# Altium schematic sheet CH9343-安卓USB转串口板V0.0.1版本.SchDoc
size A4; Organization: Altium Limited; Address1: L3, 12a Rodborough Rd; Address2: Frenchs Forest; Address3: NSW; Address4: Australia 2086
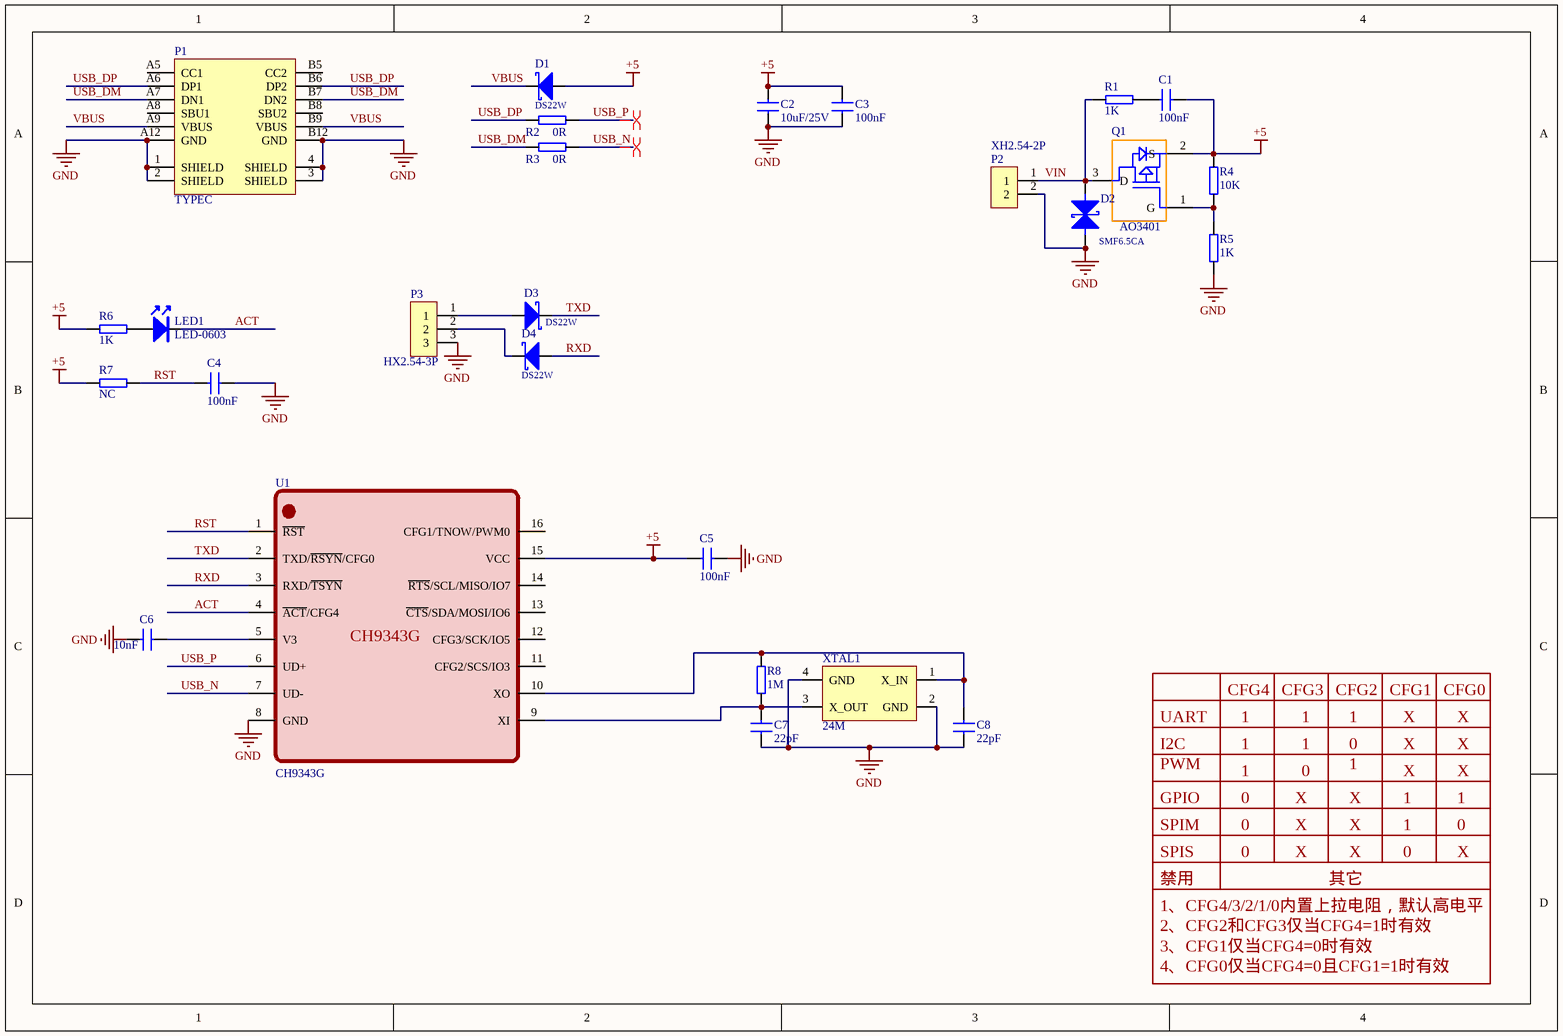
[diagram p0: CH9343-安卓USB转串口板V0.0.1版本.SchDoc]

## Parts
C1  100nF  [C-0603]
C2  10uF/25V  [C-0805]
C3  100nF  [C-0603]
C4  100nF  [C-0603]
C5  100nF  [C-0603]
C6  10nF  [C-0603]
C7  22pF  [C-0603]
C8  22pF  [C-0603]
D1  DS22W  [SOD-123F]
D2  SMF6.5CA  [DO-SOD-123FL_L2.8-W1.8-LS3.7-BI]
D3  DS22W  [SOD-123F]
D4  DS22W  [SOD-123F]
LED1  LED-0603  [LED-0603]
P1  TYPEC  [Type c-16p]
P2  XH2.54-2P  [XH2.54-2P]
P3  HX2.54-3P  [XH2.54-3P]
Q1  AO3401  [SOT-23]
R1  1K  [R-0603]
R2  0R  [R-0603]
R3  0R  [R-0603]
R4  10K  [R-0603]
R5  1K  [R-0603]
R6  1K  [R-0603]
R7  NC  [R-0603]
R8  1M  [R-0603]
U1  CH9343G  [SO-16]
XTAL1  24M  [XTAL-3225]

## Nets
+5: C1.2 C2.1 C3.2 C5.1 D1.1 Q1.2(S) R4.2 R6.2 R7.2 U1.15(VCC)
GND: C2.2 C3.1 C4.2 C5.2 C6.1 C7.1 C8.2 D2.2 P1.1(SHIELD) P1.2(SHIELD) P1.3(SHIELD) P1.4(SHIELD) P1.A12(GND) P1.B12(GND) P2.2 P3.3 R5.1 U1.8(GND) XTAL1.2(GND) XTAL1.4(GND)
ACT: LED1.2 U1.4(~{ACT}/CFG4)
RST: C4.1 R7.1 U1.1(~{RST})
RXD: D4.1 U1.3(RXD/~{TSYN})
TXD: D3.2 U1.2(TXD/~{RSYN}/CFG0)
USB_DM: P1.A7(DN1) P1.B7(DN2) R3.1
USB_DP: P1.A6(DP1) P1.B6(DP2) R2.1
USB_N: R3.2 U1.7(UD-)
USB_P: R2.2 U1.6(UD+)
VBUS: D1.2 P1.A9(VBUS) P1.B9(VBUS)
VIN: D2.1 P2.1 Q1.3(D) R1.2
NetC1_1: C1.1 R1.1
NetC6_2: C6.2 U1.5(V3)
NetC7_2: C7.2 R8.2 U1.9(XI) XTAL1.3(X_OUT)
NetC8_1: C8.1 R8.1 U1.10(XO) XTAL1.1(X_IN)
NetD3_1: D3.1 P3.1
NetD4_2: D4.2 P3.2
NetLED1_1: LED1.1 R6.1
NetQ1_1: Q1.1(G) R4.1 R5.2

Not connected (* = marked no-connect by the designer): P1 A5(CC1) A8(SBU1) B5(CC2) B8(SBU2); U1 11(CFG2/SCS/IO3) 12(CFG3/SCK/IO5) 13(~{CTS}/SDA/MOSI/IO6) 14(~{RTS}/SCL/MISO/IO7) 16(CFG1/TNOW/PWM0)

## Layout directives
differential pair: USB_N, USB_P

## Notes on the sheet
- CFG4
- CFG3
- CFG2
- CFG1
- CFG0
- UART
- I2C
- PWM
- 1
- 0
- X
- GPIO
- SPIM
- SPIS
- 禁用
- 1、CFG4/3/2/1/0内置上拉电阻，默认高电平
- 其它
- 2、CFG2和CFG3仅当CFG4=1时有效
- 3、CFG1仅当CFG4=0时有效
- 4、CFG0仅当CFG4=0且CFG1=1时有效
- Title
- Size:
- Date:
- File:
- A2
- Number:
- Time:
- Revision:
- Sheet
- of

## Library data of the parts
C1 = CAP_0603: 陶瓷电容，50V/X7R/10%; IC: *
C2 = CAP_0805: X5R/25V/10%; IC: *
C3-C6 = CAP_0603: X7R/50V/10%; IC: *
C7 C8 = CAP_0603: 50V/COG/10%; IC: *
D1 D3 D4 = D-SCHOTKY: 肖特基二极管
D2 = TVS: 双向瞬变二极管
LED1 = LED-0603: 发光二极管
P1 = Type c 16p
P2 = XH2.54-2P: 直针
P3 = XH2.54-3P: XH2.54-3P 直针 座
Q1 = MOSFET P: P沟道
R1 R4 R5 R8 = R-0603: 5% ,1/10W
R2 R3 = R-0603
R6 R7 = R-0603: 贴片电阻，5%
U1 = CH9343G: 安卓USB转串口，SO-16
XTAL1 = XTAL-3225: 贴片无源晶振